# EAGLE schematic GETEWAY (EAGLE 9.5.1)
REV: 1

## Sheet 1 of 10
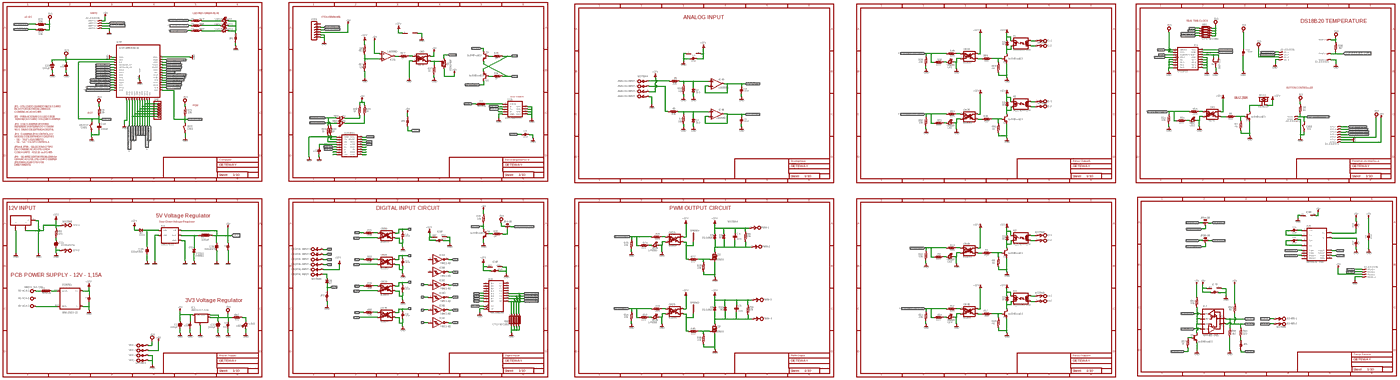
[diagram p0: schematic, sheet 1, overview]
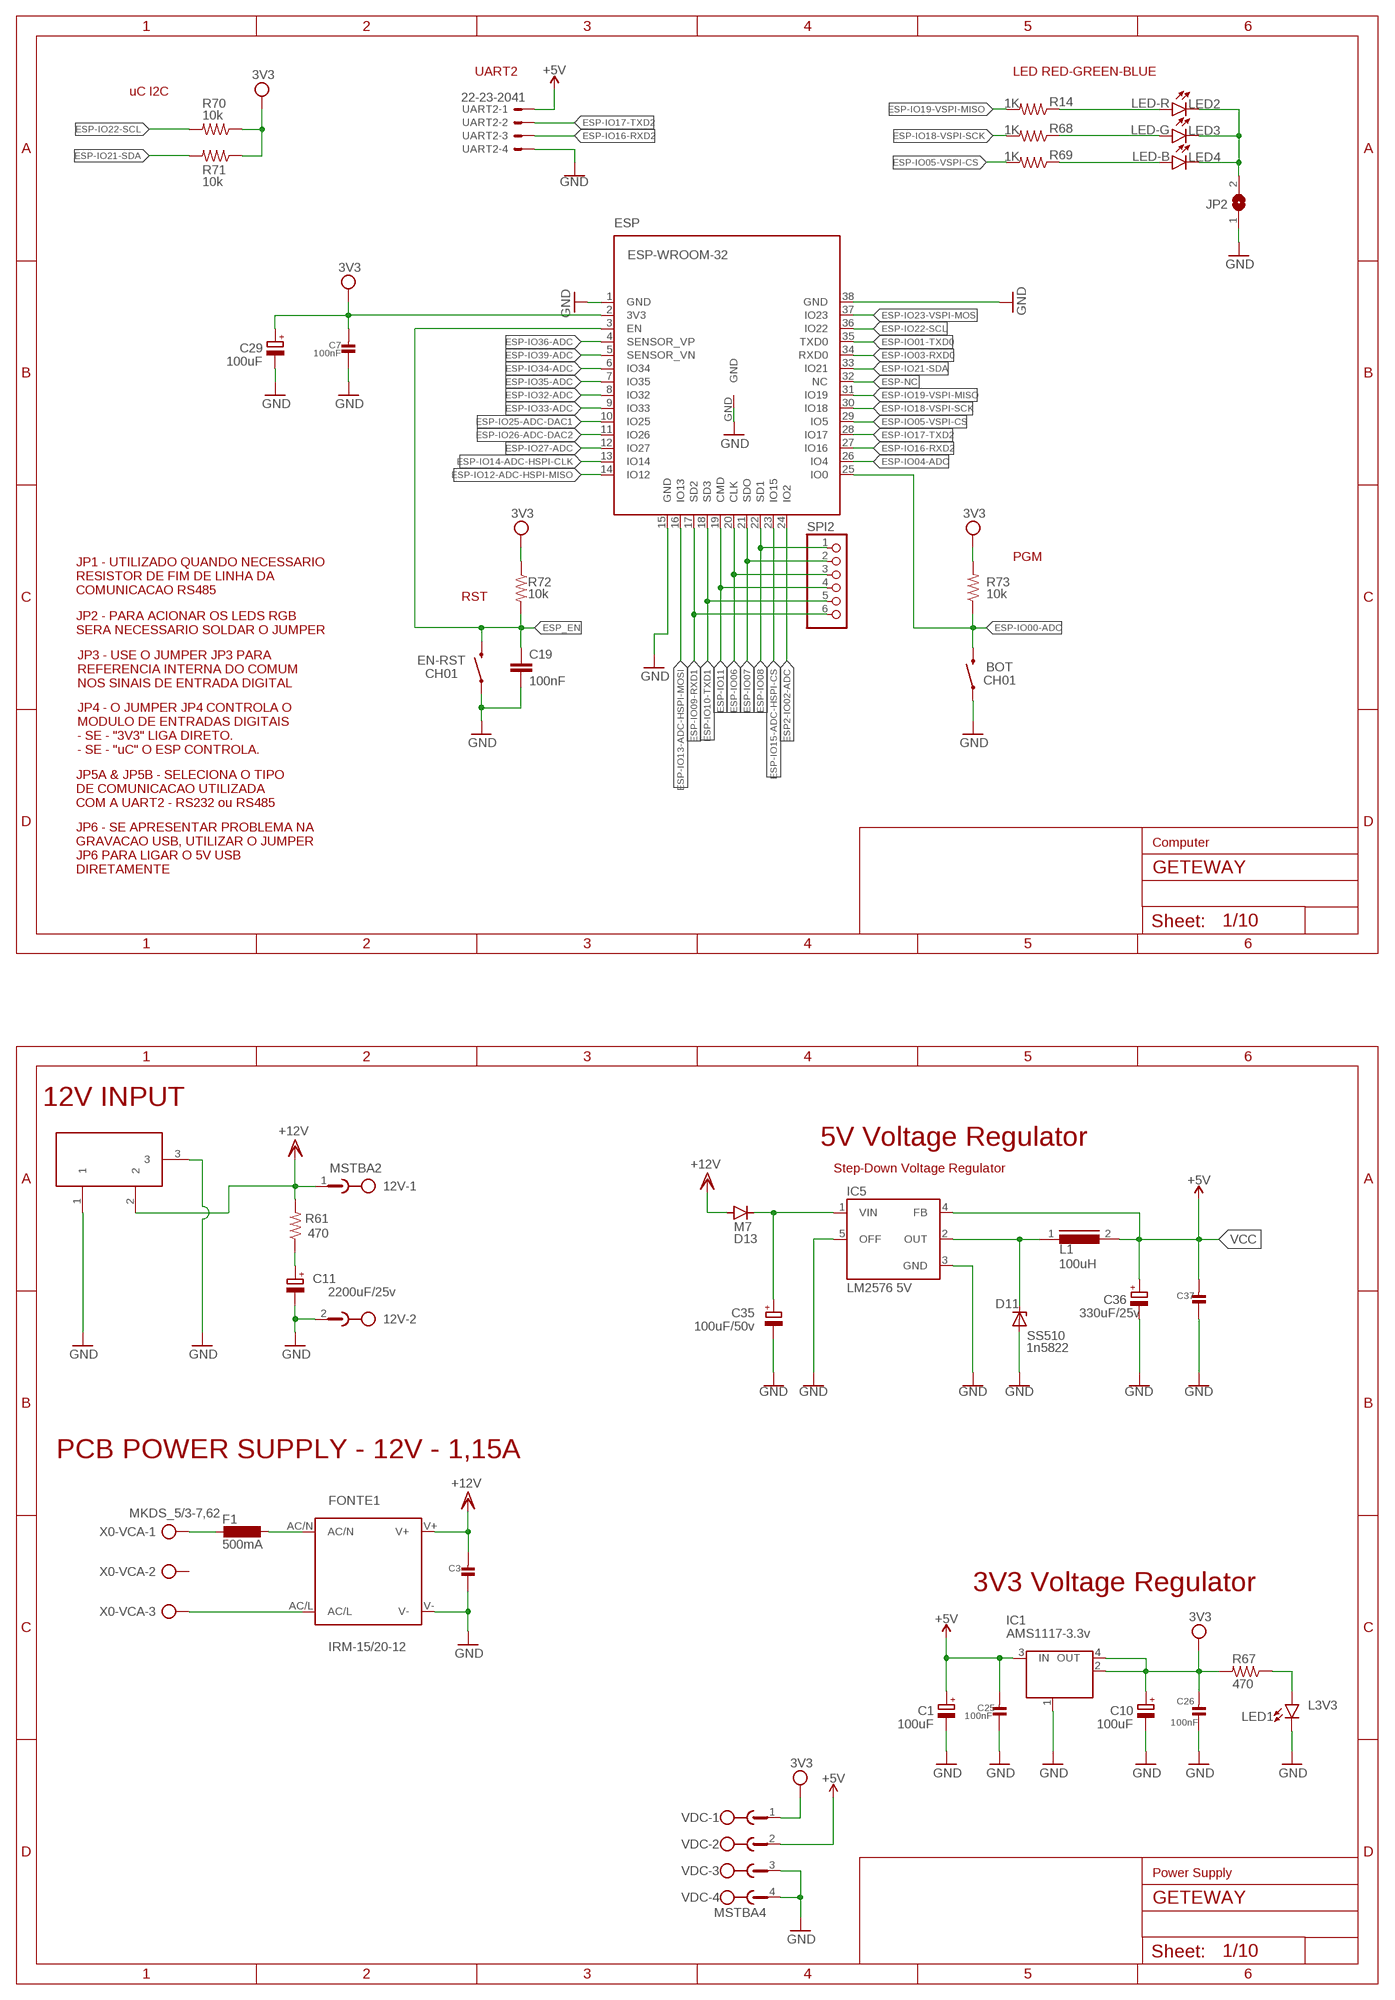
[diagram p1: schematic, sheet 1, part 1 of 4]
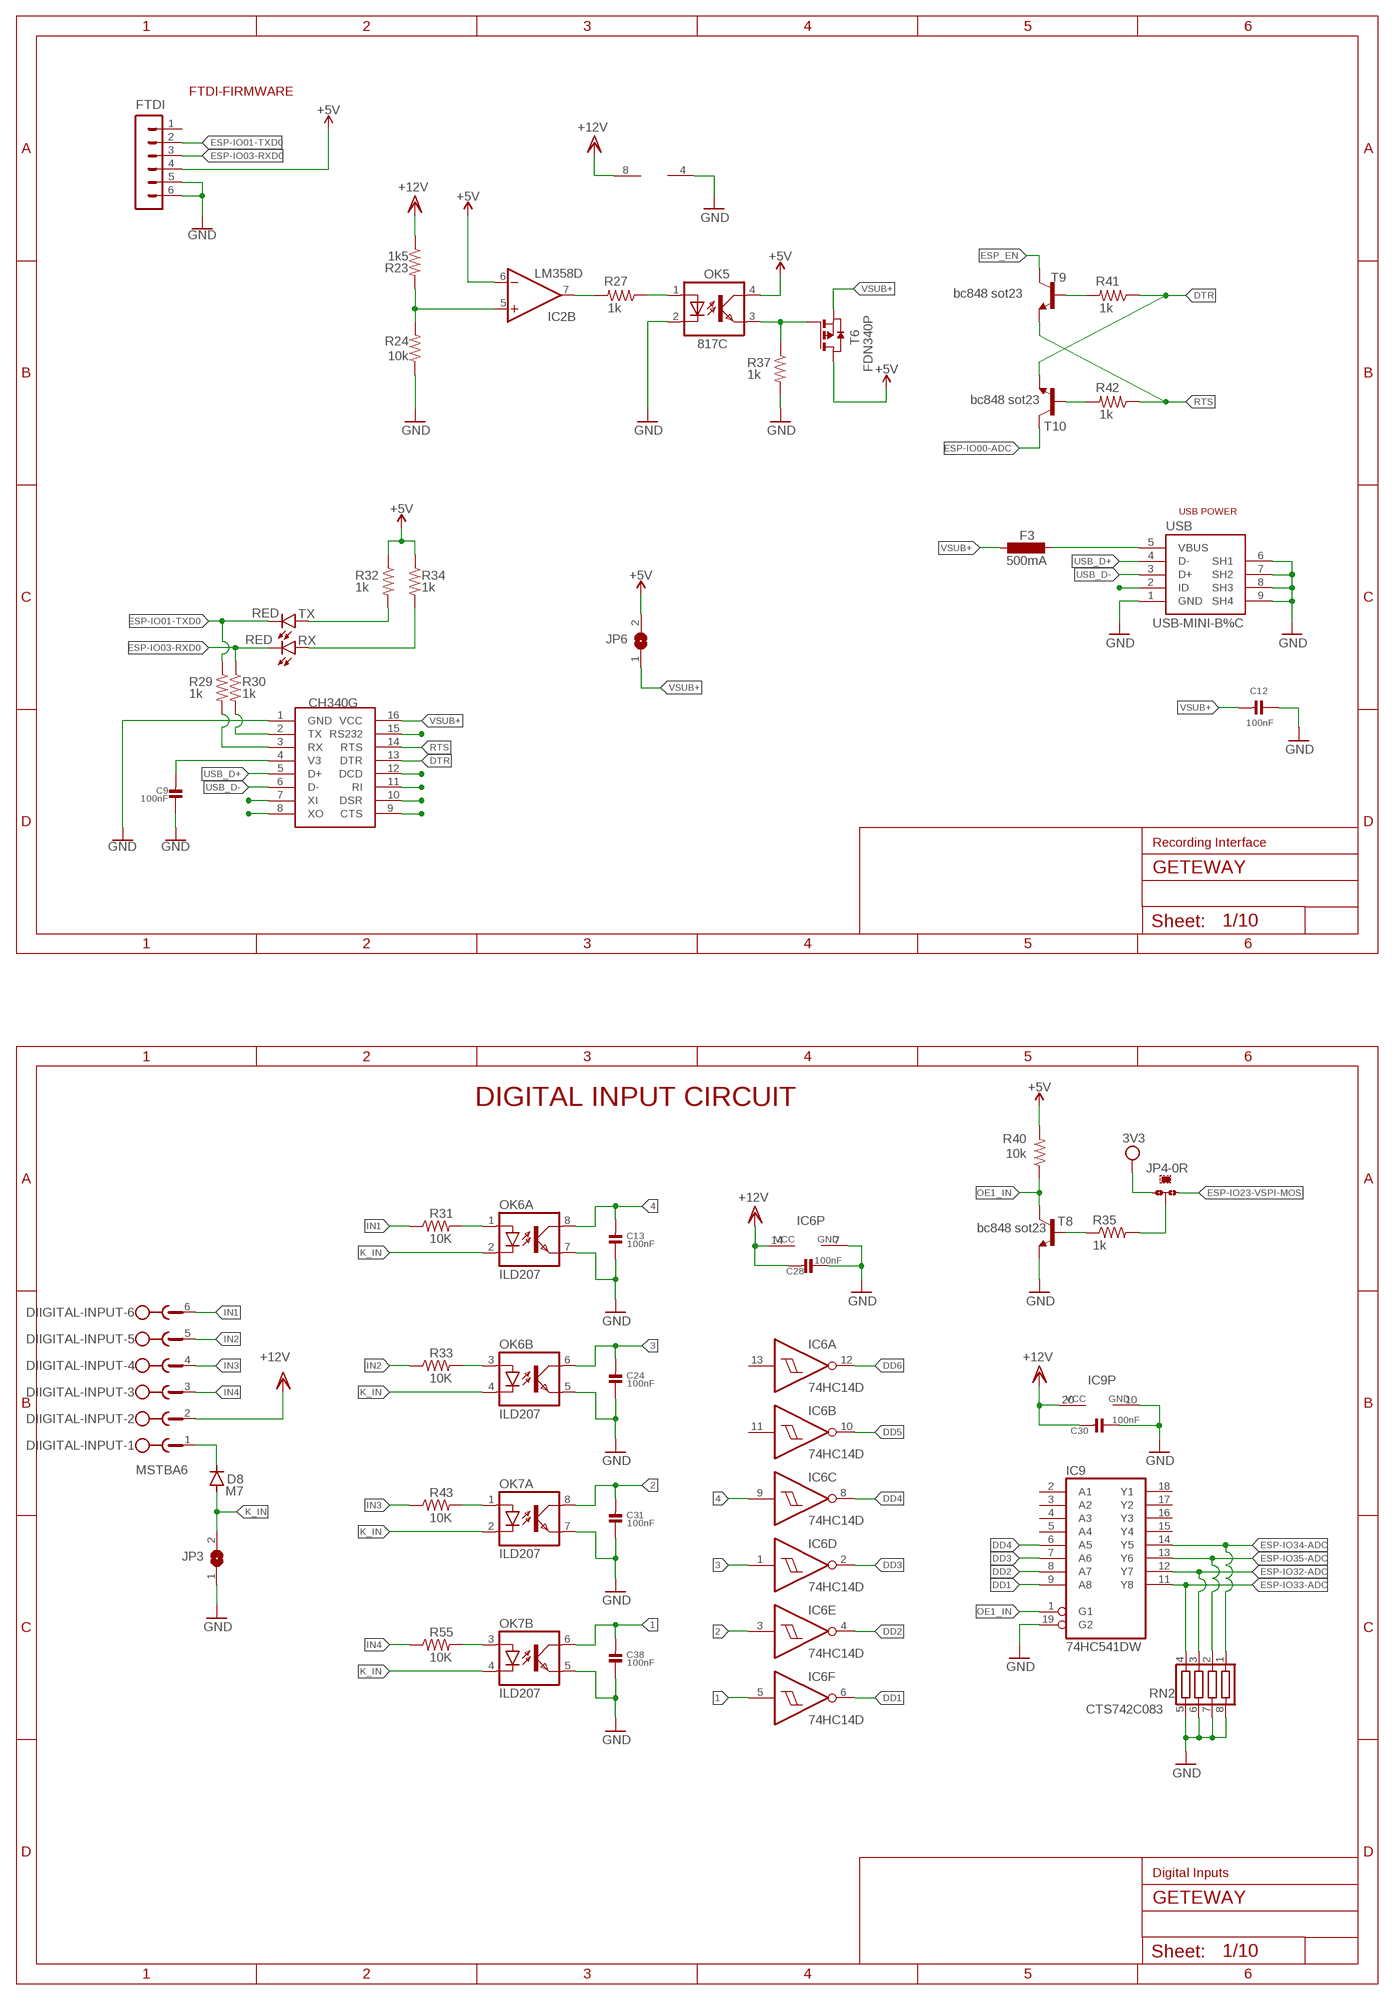
[diagram p2: schematic, sheet 1, part 2 of 4]
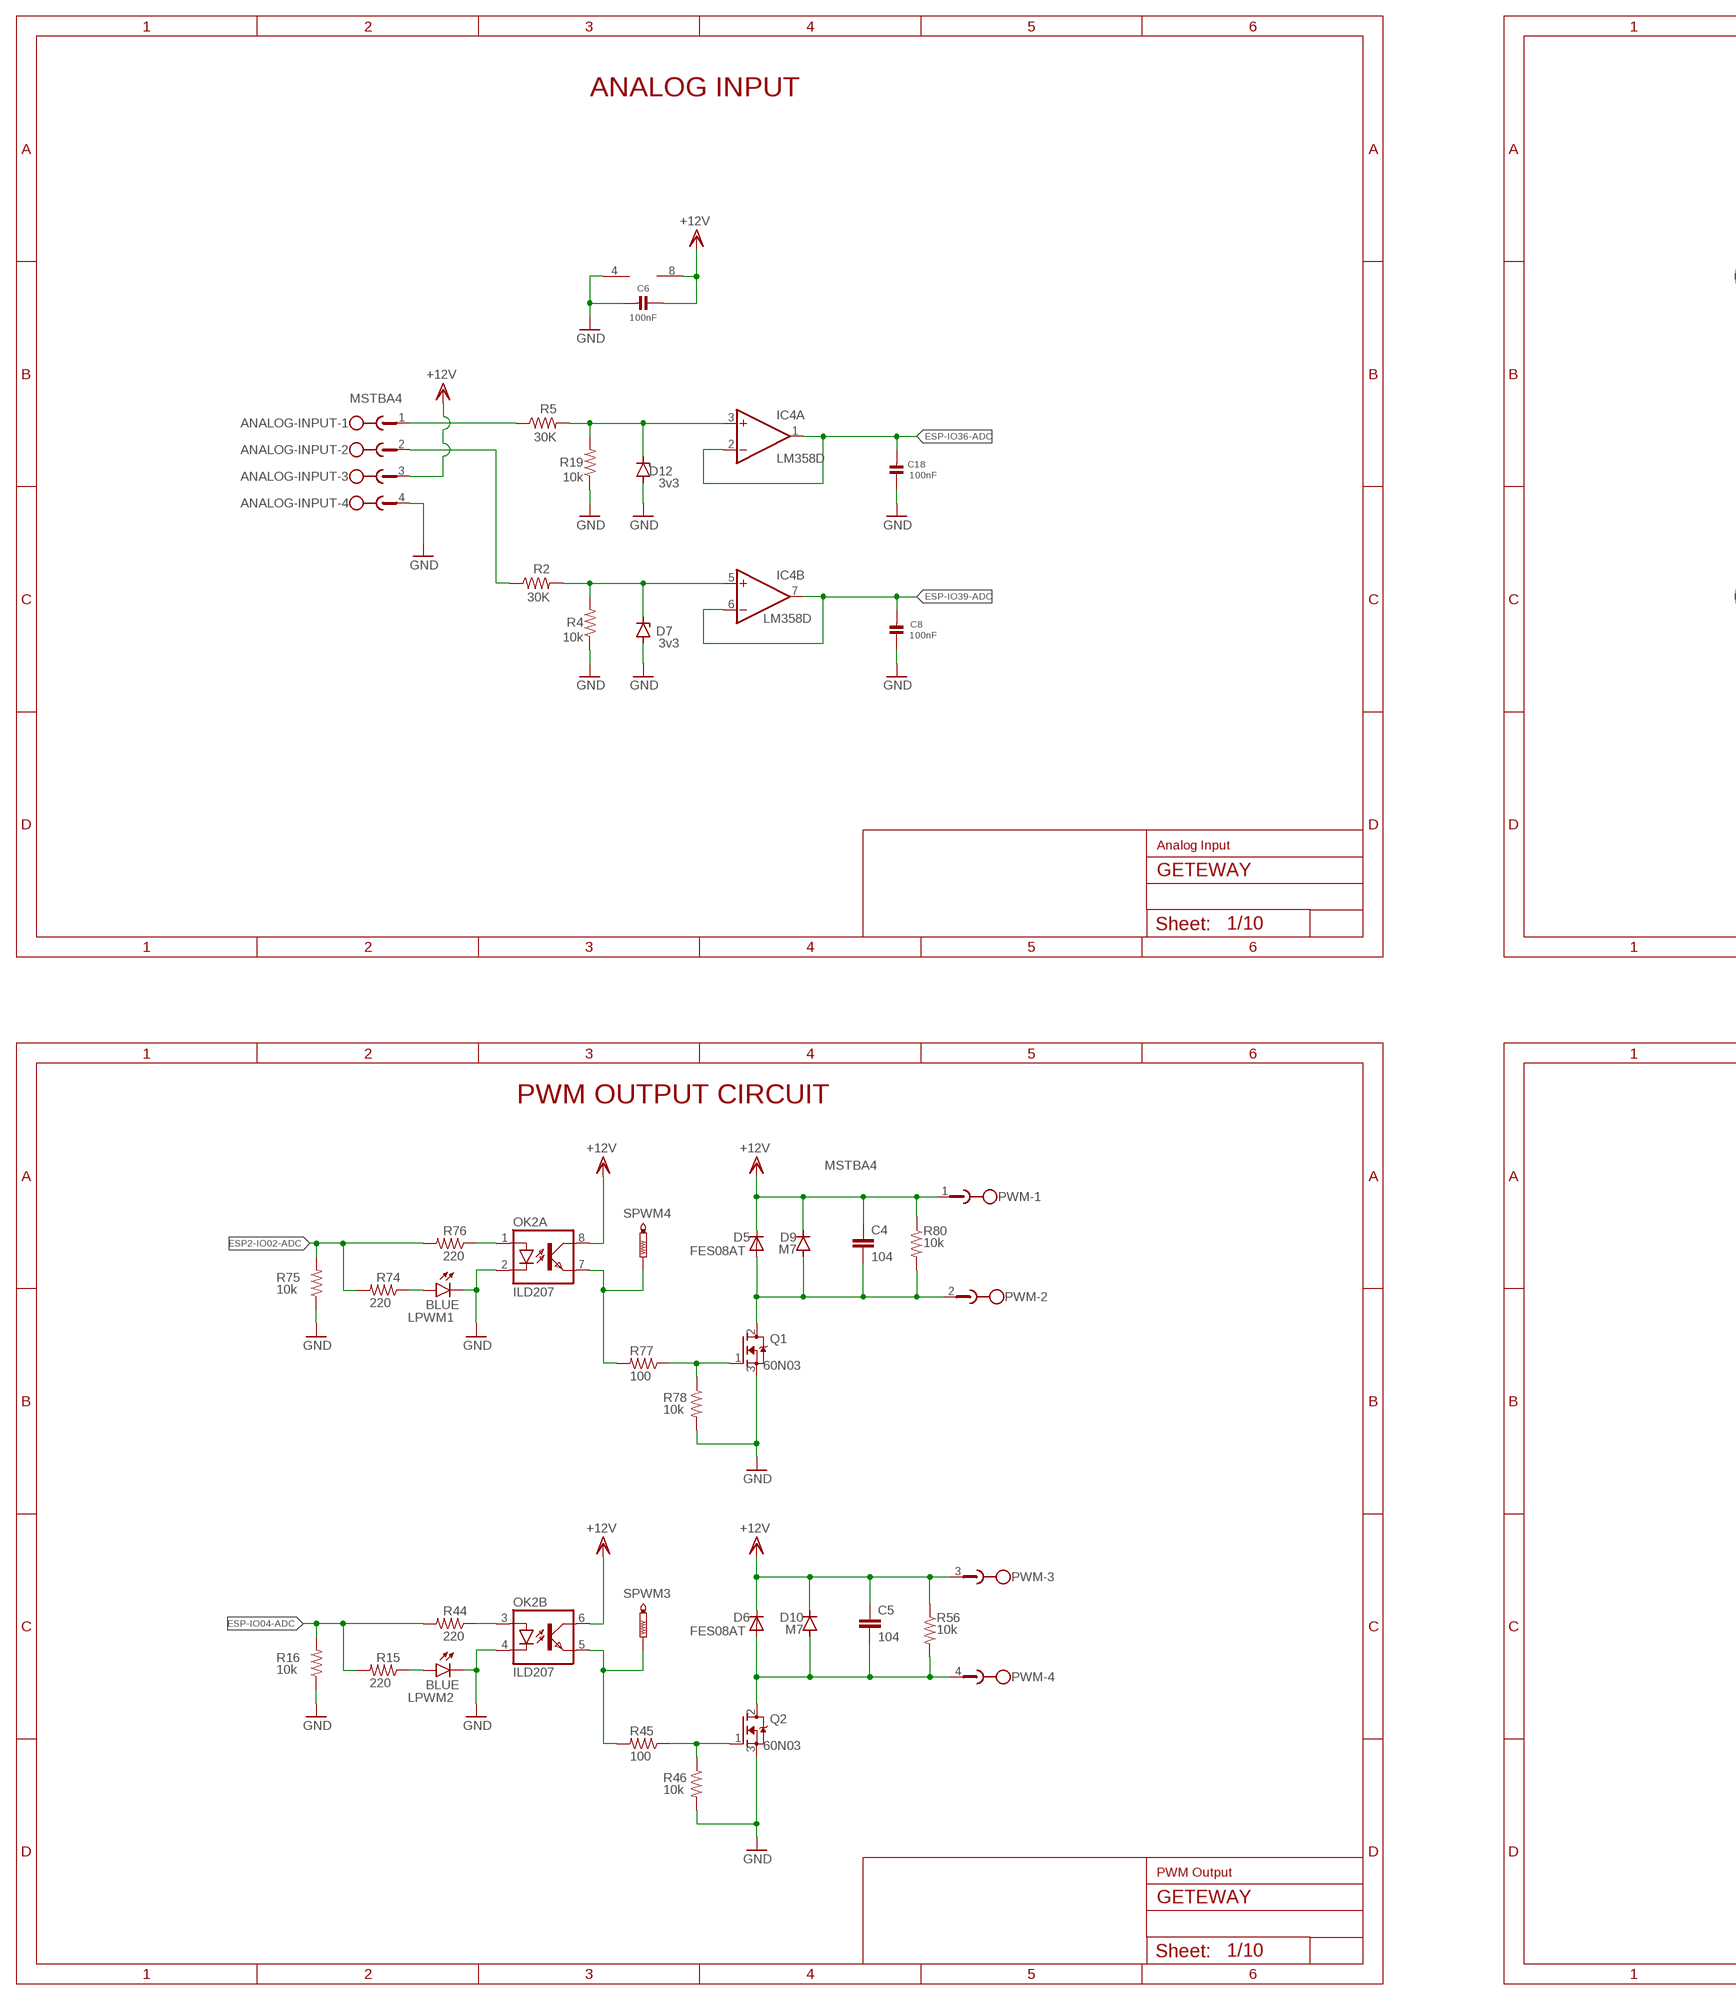
[diagram p3: schematic, sheet 1, part 3 of 4]
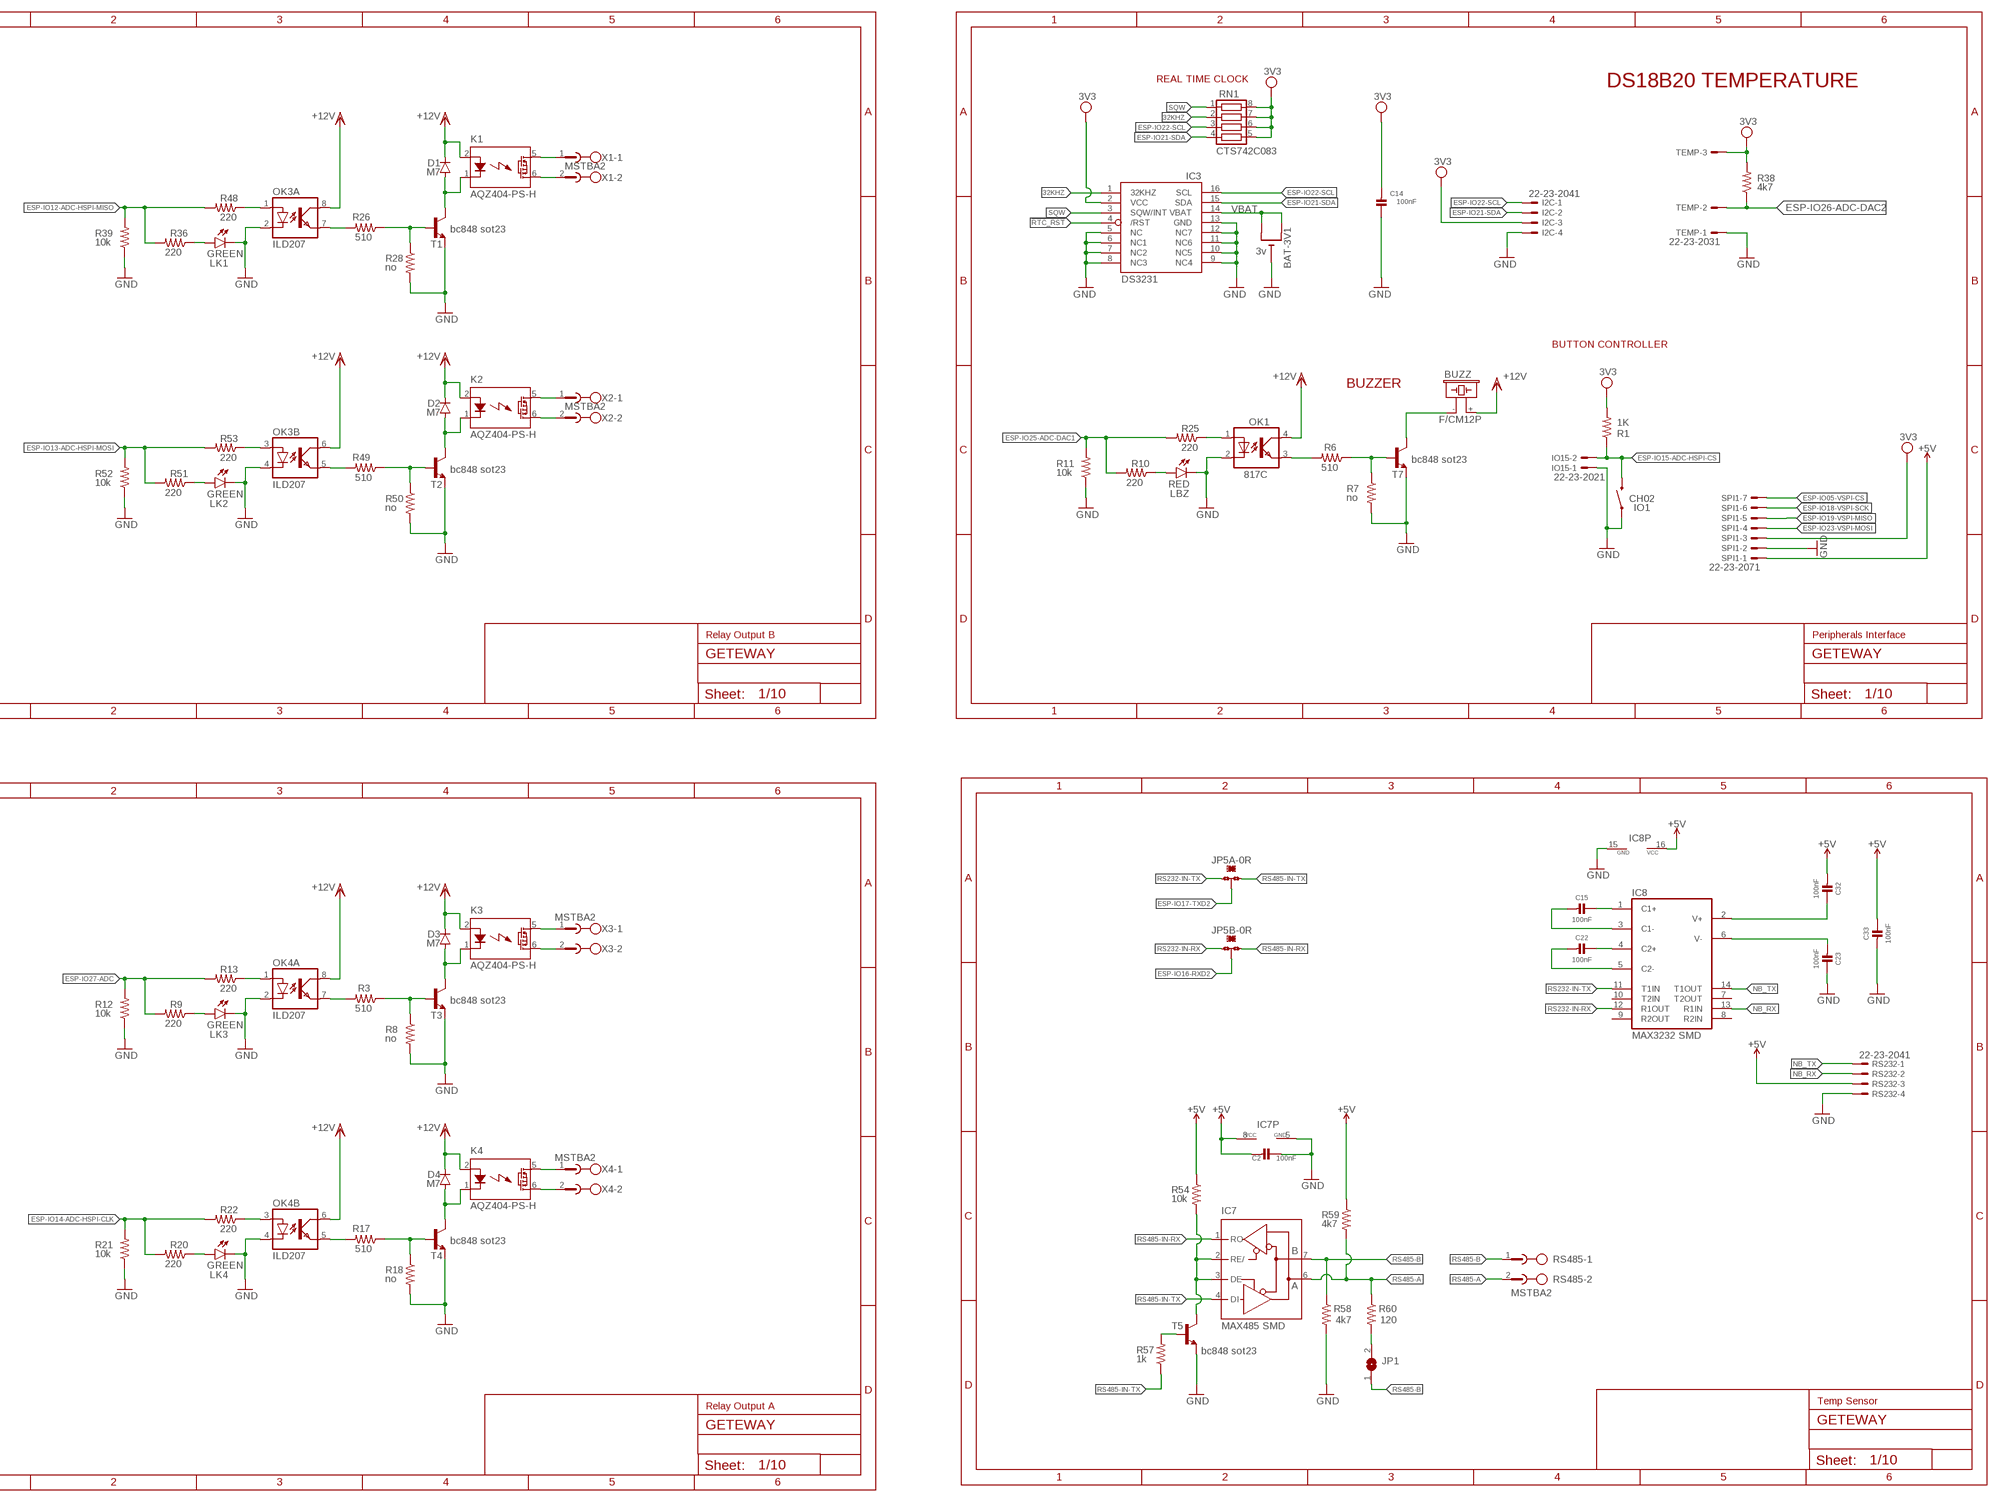
[diagram p4: schematic, sheet 1, part 4 of 4]

### Parts
7V-15VDC  DC21MMX  [DC-21MM]
12V  MSTBA2  [MSTBA2]
ANALOG-INPUT  MSTBA4  [MSTBA4]
BAT-3V1  3v  CR2032SMT  [CR2032-SMD]
BOT  CH01  MOMENTARY-SWITCH-SPST-SMD-6.0X3.5MM  [TACTILE_SWITCH_SMD_6.0X3.5MM]
BUZZ  F/CM12P  [F/CM12P]
C1  100uF  CPOL-EUE2.5-7  [E2,5-7]
C2  100nF  CAP_CERAMIC0805-NOOUTLINE  [0805-NO]
C3  100nF  CAP_CERAMIC0805-NOOUTLINE  [0805-NO]
C4  104  CAP0805  [0805]
C5  104  CAP0805  [0805]
C6  100nF  CAP_CERAMIC0805-NOOUTLINE  [0805-NO]
C7  100nF  CAP_CERAMIC0805-NOOUTLINE  [0805-NO]
C8  100nF  CAP_CERAMIC0805-NOOUTLINE  [0805-NO]
C9  100nF  CAP_CERAMIC0805-NOOUTLINE  [0805-NO]
C10  100uF  CPOL-EUE2.5-7  [E2,5-7]
C11  2200uF/25v  CPOL-EUE5-13  [E5-13]
C12  100nF  CAP_CERAMIC0805-NOOUTLINE  [0805-NO]
C13  100nF  CAP_CERAMIC0805-NOOUTLINE  [0805-NO]
C14  100nF  CAP_CERAMIC0805-NOOUTLINE  [0805-NO]
C15  100nF  CAP_CERAMIC0805-NOOUTLINE  [0805-NO]
C18  100nF  CAP_CERAMIC0805-NOOUTLINE  [0805-NO]
C19  100nF  C-EUC0603  [C0603]
C22  100nF  CAP_CERAMIC0805-NOOUTLINE  [0805-NO]
C23  100nF  CAP_CERAMIC0805-NOOUTLINE  [0805-NO]
C24  100nF  CAP_CERAMIC0805-NOOUTLINE  [0805-NO]
C25  100nF  CAP_CERAMIC0805-NOOUTLINE  [0805-NO]
C26  100nF  CAP_CERAMIC0805-NOOUTLINE  [0805-NO]
C28  100nF  CAP_CERAMIC0805-NOOUTLINE  [0805-NO]
C29  100uF  CPOL-EUE2.5-7  [E2,5-7]
C30  100nF  CAP_CERAMIC0805-NOOUTLINE  [0805-NO]
C31  100nF  CAP_CERAMIC0805-NOOUTLINE  [0805-NO]
C32  100nF  CAP_CERAMIC0805-NOOUTLINE  [0805-NO]
C33  100nF  CAP_CERAMIC0805-NOOUTLINE  [0805-NO]
C35  100uF/50v  CPOL-EUE3.5-8  [E3,5-8]
C36  330uF/25v  CPOL-EUE3.5-8  [E3,5-8]
C37  100nF  CAP_CERAMIC0805-NOOUTLINE  [0805-NO]
C38  100nF  CAP_CERAMIC0805-NOOUTLINE  [0805-NO]
D1  M7  DIODE-SMB  [SMB]
D2  M7  DIODE-SMB  [SMB]
D3  M7  DIODE-SMB  [SMB]
D4  M7  DIODE-SMB  [SMB]
D5  FES08AT  [DO220S]
D6  FES08AT  [DO220S]
D7  3v3  ZENER-DIODESMB  [SMB]
D8  M7  DIODE-SMB  [SMB]
D9  M7  DIODE-SMB  [SMB]
D10  M7  DIODE-SMB  [SMB]
D11  SS510  ZENER-DIODESMB  [SMB]
D12  3v3  ZENER-DIODESMB  [SMB]
D13  M7  DIODE-SMB  [SMB]
DIIGITAL-INPUT  MSTBA6  [MSTBA6]
EN-RST  CH01  MOMENTARY-SWITCH-SPST-SMD-6.0X3.5MM  [TACTILE_SWITCH_SMD_6.0X3.5MM]
ESP  ESP-WROOM-32  [ESP-WROOM-32]
F1  500mA  L-EUL1812  [L1812]
F3  500mA  L-EUL1812  [L1812]
FONTE1  IRM-15/20-12  IRM_15/20  [IRM_15/20]
FTDI  MA06-1  [MA06-1]
I2C  22-23-2041  [22-23-2041]
IC1  AMS1117-3.3v  MC33269ST-3.3T3  [SOT223]
IC2  LM358D  [SO08]
IC3  DS3231/SO  [SO16W]
IC4  LM358D  [SO08]
IC5  LM2576 5V  LM2576S  [TO263-5]
IC6  74HC14D  [SO14]
IC7  MAX485 SMD  MAX481CSA  [SO08]
IC8  MAX3232 SMD  MAX3232CSE  [SO16]
IC9  74HC541DW  [SO20W]
IO1  CH02  MOMENTARY-SWITCH-SPST-SMD-6.0X3.5MM  [TACTILE_SWITCH_SMD_6.0X3.5MM]
IO15  22-23-2021  [22-23-2021]
JP1  SJ  [SJ]
JP2  SJ  [SJ]
JP3  SJ  [SJ]
JP4  0R-JUMPA  [A0R-JMP]
JP5A  0R-JUMPA  [A0R-JMP]
JP5B  0R-JUMPA  [A0R-JMP]
JP6  SJ  [SJ]
K1  AQZ404-PS-H  [AQZ404-PS-H]
K2  AQZ404-PS-H  [AQZ404-PS-H]
K3  AQZ404-PS-H  [AQZ404-PS-H]
K4  AQZ404-PS-H  [AQZ404-PS-H]
L1  100uH  DR125  [DR125]
L3V3  LED1  LEDCHIPLED_0805  [CHIPLED_0805]
LBZ  RED  LEDCHIPLED_0805  [CHIPLED_0805]
LED-B  LED4  LEDCHIPLED_0805  [CHIPLED_0805]
LED-G  LED3  LEDCHIPLED_0805  [CHIPLED_0805]
LED-R  LED2  LEDCHIPLED_0805  [CHIPLED_0805]
LK1  GREEN  LEDCHIPLED_0805  [CHIPLED_0805]
LK2  GREEN  LEDCHIPLED_0805  [CHIPLED_0805]
LK3  GREEN  LEDCHIPLED_0805  [CHIPLED_0805]
LK4  GREEN  LEDCHIPLED_0805  [CHIPLED_0805]
LPWM1  BLUE  LEDCHIPLED_0805  [CHIPLED_0805]
LPWM2  BLUE  LEDCHIPLED_0805  [CHIPLED_0805]
OK1  817C  SFH618A-5X007  [SMD4-7]
OK2  ILD207  [SOIC08]
OK3  ILD207  [SOIC08]
OK4  ILD207  [SOIC08]
OK5  817C  SFH618A-5X007  [SMD4-7]
OK6  ILD207  [SOIC08]
OK7  ILD207  [SOIC08]
PWM  MSTBA4  [MSTBA4]
Q1  60N03  AP70T03GH-HF-3TR  [TRANS_AP70T03GH-HF-3TR]
Q2  60N03  AP70T03GH-HF-3TR  [TRANS_AP70T03GH-HF-3TR]
R1  1K  R-US_R0805  [R0805]
R2  30K  R-US_R0603  [R0603]
R3  510  R-US_R0603  [R0603]
R4  10k  R-US_R0603  [R0603]
R5  30K  R-US_R0603  [R0603]
R6  510  R-US_R0603  [R0603]
R7  no  R-US_R0603  [R0603]
R8  no  R-US_R0603  [R0603]
R9  220  R-US_R0603  [R0603]
R10  220  R-US_R0603  [R0603]
R11  10k  R-US_R0603  [R0603]
R12  10k  R-US_R0603  [R0603]
R13  220  R-US_R0603  [R0603]
R14  1K  R-US_R0805  [R0805]
R15  220  R-US_R0603  [R0603]
R16  10k  R-US_R0603  [R0603]
R17  510  R-US_R0603  [R0603]
R18  no  R-US_R0603  [R0603]
R19  10k  R-US_R0603  [R0603]
R20  220  R-US_R0603  [R0603]
R21  10k  R-US_R0603  [R0603]
R22  220  R-US_R0603  [R0603]
R23  1k5  R-US_R0603  [R0603]
R24  10k  R-US_R0603  [R0603]
R25  220  R-US_R0603  [R0603]
R26  510  R-US_R0603  [R0603]
R27  1k  R-US_R0603  [R0603]
R28  no  R-US_R0603  [R0603]
R29  1k  R-US_R0603  [R0603]
R30  1k  R-US_R0603  [R0603]
R31  10K  R-US_M1206  [M1206]
R32  1k  R-US_R0603  [R0603]
R33  10K  R-US_M1206  [M1206]
R34  1k  R-US_R0603  [R0603]
R35  1k  R-US_R0603  [R0603]
R36  220  R-US_R0603  [R0603]
R37  1k  R-US_R0603  [R0603]
R38  4k7  R-US_R0603  [R0603]
R39  10k  R-US_R0603  [R0603]
R40  10k  R-US_R0603  [R0603]
R41  1k  R-US_R0603  [R0603]
R42  1k  R-US_R0603  [R0603]
R43  10K  R-US_M1206  [M1206]
R44  220  R-US_R0603  [R0603]
R45  100  R-US_R0603  [R0603]
R46  10k  R-US_R0603  [R0603]
R48  220  R-US_R0603  [R0603]
R49  510  R-US_R0603  [R0603]
R50  no  R-US_R0603  [R0603]
R51  220  R-US_R0603  [R0603]
R52  10k  R-US_R0603  [R0603]
R53  220  R-US_R0603  [R0603]
R54  10k  R-US_R0603  [R0603]
R55  10K  R-US_M1206  [M1206]
R56  10k  R-US_R0603  [R0603]
R57  1k  R-US_R0603  [R0603]
R58  4k7  R-US_R0603  [R0603]
R59  4k7  R-US_R0603  [R0603]
R60  120  R-US_R0603  [R0603]
R61  470  R-US_M1206  [M1206]
R67  470  R-US_R0603  [R0603]
R68  1K  R-US_R0805  [R0805]
R69  1K  R-US_R0805  [R0805]
R70  10k  R-US_R0603  [R0603]
R71  10k  R-US_R0603  [R0603]
R72  10k  R-US_R0603  [R0603]
R73  10k  R-US_R0603  [R0603]
R74  220  R-US_R0603  [R0603]
R75  10k  R-US_R0603  [R0603]
R76  220  R-US_R0603  [R0603]
R77  100  R-US_R0603  [R0603]
R78  10k  R-US_R0603  [R0603]
R80  10k  R-US_R0603  [R0603]
RN1  CTS742C083  [CTS742C083]
RN2  CTS742C083  [CTS742C083]
RS232  22-23-2041  [22-23-2041]
RS485  MSTBA2  [MSTBA2]
RX  RED  LEDCHIPLED_0805  [CHIPLED_0805]
SPI1  22-23-2071  [22-23-2071]
SPI2  PINHD-1X6  [1X06]
SPWM3  PTR1PAD1-17  [P1-17]
SPWM4  PTR1PAD1-17  [P1-17]
T1  bc848 sot23  BC848-NPN-SOT23-BEC  [SOT23-BEC]
T2  bc848 sot23  BC848-NPN-SOT23-BEC  [SOT23-BEC]
T3  bc848 sot23  BC848-NPN-SOT23-BEC  [SOT23-BEC]
T4  bc848 sot23  BC848-NPN-SOT23-BEC  [SOT23-BEC]
T5  bc848 sot23  BC848-NPN-SOT23-BEC  [SOT23-BEC]
T6  FDN340P  PMOSSOT23  [SOT-23]
T7  bc848 sot23  BC848-NPN-SOT23-BEC  [SOT23-BEC]
T8  bc848 sot23  MMBT3904LT1-NPN-SOT23-BEC  [SOT23-BEC]
T9  bc848 sot23  MMBT3904LT1-NPN-SOT23-BEC  [SOT23-BEC]
T10  bc848 sot23  MMBT3904LT1-NPN-SOT23-BEC  [SOT23-BEC]
TEMP  22-23-2031  [22-23-2031]
TX  RED  LEDCHIPLED_0805  [CHIPLED_0805]
U2  CH340G  [SOIC16]
UART2  22-23-2041  [22-23-2041]
USB  USB-MINI-B%C  [USB-MINI-B_2]
VDC  MSTBA4  [MSTBA4]
X0-VCA  MKDS_5/3-7,62  [MKDS_5/3-762]
X1  MSTBA2  [MSTBA2]
X2  MSTBA2  [MSTBA2]
X3  MSTBA2  [MSTBA2]
X4  MSTBA2  [MSTBA2]

### Nets
1: C38.2 IC6.5(F:I) OK7.6(B:COL)
2: C31.2 IC6.3(E:I) OK7.8(A:COL)
3: C24.2 IC6.1(D:I) OK6.6(B:COL)
4: C13.2 IC6.9(C:I) OK6.8(A:COL)
32KHZ: IC3.1(32KHZ) RN1.2
!RTC_RST: IC3.4(/RST)
DD1: IC6.6(F:O) IC9.9(A8)
DD2: IC6.4(E:O) IC9.8(A7)
DD3: IC6.2(D:O) IC9.7(A6)
DD4: IC6.8(C:O) IC9.6(A5)
DD5: IC6.10(B:O)
DD6: IC6.12(A:O)
DTR: R41.1 T10.E U2.13(DTR)
ESP2-IO02-ADC: ESP.24(IO2) R74.2 R75.2 R76.2
ESP-IO00-ADC: BOT.2 ESP.25(IO0) R73.1 T10.C
ESP-IO01-TXD0: ESP.35(TXD0) FTDI.2 R29.1 TX.C
ESP-IO03-RXD0: ESP.34(RXD0) FTDI.3 R30.1 RX.C
ESP-IO04-ADC: ESP.26(IO4) R15.2 R16.2 R44.2
ESP-IO05-VSPI-CS: ESP.29(IO5) R69.2 SPI1.7
ESP-IO06: ESP.20(CLK) SPI2.3
ESP-IO07: ESP.21(SDO) SPI2.2
ESP-IO08: ESP.22(SD1) SPI2.1
ESP-IO09-RXD1: ESP.17(SD2) SPI2.6
ESP-IO10-TXD1: ESP.18(SD3) SPI2.5
ESP-IO11: ESP.19(CMD) SPI2.4
ESP-IO12-ADC-HSPI-MISO: ESP.14(IO12) R36.2 R39.2 R48.2
ESP-IO13-ADC-HSPI-MOSI: ESP.16(IO13) R51.2 R52.2 R53.2
ESP-IO14-ADC-HSPI-CLK: ESP.13(IO14) R20.2 R21.2 R22.2
ESP-IO15-ADC-HSPI-CS: ESP.23(IO15) IO1.2 IO15.2 R1.1
ESP-IO16-RXD2: ESP.27(IO16) JP5B.2 UART2.3
ESP-IO17-TXD2: ESP.28(IO17) JP5A.2 UART2.2
ESP-IO18-VSPI-SCK: ESP.30(IO18) R68.2 SPI1.6
ESP-IO19-VSPI-MISO: ESP.31(IO19) R14.2 SPI1.5
ESP-IO21-SDA: ESP.33(IO21) I2C.2 IC3.15(SDA) R71.2 RN1.4
ESP-IO22-SCL: ESP.36(IO22) I2C.1 IC3.16(SCL) R70.2 RN1.3
ESP-IO23-VSPI-MOSI: ESP.37(IO23) JP4.1 SPI1.4
ESP-IO25-ADC-DAC1: ESP.10(IO25) R10.2 R11.2 R25.2
ESP-IO26-ADC-DAC2: ESP.11(IO26) R38.1 TEMP.2
ESP-IO27-ADC: ESP.12(IO27) R9.2 R12.2 R13.2
ESP-IO32-ADC: ESP.8(IO32) IC9.12(Y7) RN2.3
ESP-IO33-ADC: ESP.9(IO33) IC9.11(Y8) RN2.4
ESP-IO34-ADC: ESP.6(IO34) IC9.14(Y5) RN2.1
ESP-IO35-ADC: ESP.7(IO35) IC9.13(Y6) RN2.2
ESP-IO36-ADC: C18.2 ESP.4(SENSOR_VP) IC4.1(A:OUT) IC4.2(A:-IN)
ESP-IO36-ADC1: IC2.7(B:OUT) R27.2
ESP-IO39-ADC: C8.2 ESP.5(SENSOR_VN) IC4.6(B:-IN) IC4.7(B:OUT)
ESP-NC: ESP.32(NC)
ESP_EN: C19.1 EN-RST.2 ESP.3(EN) R72.2 T9.C
GND [power]: 7V-15VDC.1 7V-15VDC.3 12V.2 ANALOG-INPUT.4 BAT-3V1.- BOT.1 C1.- C2.1 C3.1 C6.2 C7.1 C8.1 C9.1 C10.- C11.- C12.1 C13.1 C14.1 C18.1 C19.2 C23.1 C24.1 C25.1 C26.1 C28.1 C29.- C30.1 C31.1 C33.2 C35.- C36.- C37.1 C38.1 D7.A D11.A D12.A EN-RST.1 ESP.1(GND) ESP.15(GND) ESP.38(GND) ESP.GND FONTE1.V- FTDI.5 FTDI.6 I2C.4 IC1.1(GND/ADJ) IC2.4(P:V-) IC3.5(NC) IC3.6(NC1) IC3.7(NC2) IC3.8(NC3) IC3.9(NC4) IC3.10(NC5) IC3.11(NC6) IC3.12(NC7) IC3.13(GND) IC4.4(P:V-) IC5.3(GND) IC5.5(OFF) IC6.7(P:GND) IC7.5(GND) IC8.15(GND) IC9.10(GND) IC9.19(G2) IO1.1 IO15.1 JP2.1 JP3.1 L3V3.C LBZ.C LK1.C LK2.C LK3.C LK4.C LPWM1.C LPWM2.C OK1.2(C) OK2.2(A:C) OK2.4(B:C) OK3.2(A:C) OK3.4(B:C) OK4.2(A:C) OK4.4(B:C) OK5.2(C) OK6.5(B:EMIT) OK6.7(A:EMIT) OK7.5(B:EMIT) OK7.7(A:EMIT) Q1.3(S) Q2.3(S) R4.1 R7.2 R8.2 R11.1 R12.1 R16.1 R18.2 R19.1 R21.1 R24.1 R28.2 R37.2 R39.1 R46.2 R50.2 R52.1 R58.2 R75.1 R78.2 RN2.5 RN2.6 RN2.7 RN2.8 RS232.4 SPI1.2 T1.E T2.E T3.E T4.E T5.E T7.E T8.E TEMP.1 U2.1(GND) UART2.4 USB.1(GND) USB.6(SH1) USB.7(SH2) USB.8(SH3) USB.9(SH4) VDC.3 VDC.4
IN1: DIIGITAL-INPUT.6 R31.1
IN2: DIIGITAL-INPUT.5 R33.1
IN3: DIIGITAL-INPUT.4 R43.1
IN4: DIIGITAL-INPUT.3 R55.1
K_IN: D8.A JP3.2 OK6.2(A:C) OK6.4(B:C) OK7.2(A:C) OK7.4(B:C)
N$1: D1.A K1.1(K) T1.C
N$2: R26.1 R28.1 T1.B
N$3: OK3.7(A:EMIT) R26.2
N$4: C15.1 IC8.1(C1+)
N$5: C15.2 IC8.3(C1-)
N$6: C22.1 IC8.4(C2+)
N$7: C22.2 IC8.5(C2-)
N$8: C23.2 IC8.6(V-)
N$9: C32.1 IC8.2(V+)
N$10: BUZZ.- T7.C
N$11: R6.1 R7.1 T7.B
N$12: K1.5(DS1) X1.1
N$13: K1.6(DS2) X1.2
N$14: K2.5(DS1) X2.1
N$15: ANALOG-INPUT.1 R5.1
N$16: ANALOG-INPUT.2 R2.1
N$17: D3.A K3.1(K) T3.C
N$18: OK3.1(A:A) R48.1
N$19: D7.C IC4.5(B:+IN) R2.2 R4.2
N$20: OK1.3(EMIT) R6.2
N$21: OK1.1(A) R25.1
N$22: R3.1 R8.1 T3.B
N$23: LBZ.A R10.1
N$24: LK1.A R36.1
N$25: OK4.7(A:EMIT) R3.2
N$26: USB.2(ID)
N$27: LED-R.A R14.1
N$28: R35.1 T8.B
N$29: D2.A K2.1(K) T2.C
N$30: K3.5(DS1) X3.1
N$31: K3.6(DS2) X3.2
N$32: K4.5(DS1) X4.1
N$33: R49.1 R50.1 T2.B
N$34: OK6.1(A:A) R31.2
N$35: OK6.3(B:A) R33.2
N$36: OK4.1(A:A) R13.1
N$37: LK3.A R9.1
N$38: LED-G.A R68.1
N$39: LED-B.A R69.1
N$40: D4.A K4.1(K) T4.C
N$41: R17.1 R18.1 T4.B
N$42: OK3.5(B:EMIT) R49.2
N$43: OK2.3(B:A) R44.1
N$45 [power]: JP2.2 LED-B.C LED-G.C LED-R.C
N$46: U2.8(XO)
N$47: U2.7(XI)
N$48: C9.2 U2.4(V3)
N$49: R29.2 U2.3(RX)
N$50: R30.2 U2.2(TX)
N$51 [vcc]: R34.2 RX.A
N$52: OK7.1(A:A) R43.2
N$53: LPWM2.A R15.1
N$54: OK7.3(B:A) R55.2
N$55: OK2.5(B:EMIT) R45.2 SPWM3.TP
N$56: D8.C DIIGITAL-INPUT.1
N$57: JP4.2 R35.2
N$58: D12.C IC4.3(A:+IN) R5.2 R19.2
N$59: K2.6(DS2) X2.2
N$60: F1.2 X0-VCA.1
N$61: F1.1 FONTE1.AC/N
N$62: OK3.3(B:A) R53.1
N$63: LK2.A R51.1
N$64: IC2.5(B:+IN) R23.2 R24.2
N$65: K4.6(DS2) X4.2
N$66: OK5.1(A) R27.1
N$67: Q2.1(G) R45.1 R46.1
N$68: C5.2 D6.A D10.A PWM.4 Q2.2(D) R56.2
N$69: OK2.1(A:A) R76.1
N$70: LPWM1.A R74.1
N$71: OK2.7(A:EMIT) R77.2 SPWM4.TP
N$72: Q1.1(G) R77.1 R78.1
N$73: OK5.3(EMIT) R37.1 T6.3(G)
N$74: F3.1 USB.5(VBUS)
N$75: FONTE1.AC/L X0-VCA.3
N$78: C4.2 D5.A D9.A PWM.2 Q1.2(D) R80.2
N$82: R57.2 T5.B
N$83: IC7.2(RE/) IC7.3(DE) R54.2 T5.C
N$86: L3V3.A R67.1
N$87: C11.+ R61.1
N$88: JP1.2 R60.2
N$91: D11.C IC5.2(OUT) L1.1
N$92 [power]: C35.+ D13.C IC5.1(VIN)
N$93 [vcc]: R32.2 TX.A
N$95: U2.15(RS232)
N$96: R42.2 T10.B
N$97: OK4.5(B:EMIT) R17.2
N$101: OK4.3(B:A) R22.1
N$102: R41.2 T9.B
N$103: U2.12(DCD)
N$104: U2.11(RI)
N$105: U2.10(DSR)
N$106: U2.9(CTS)
N$107: LK4.A R20.1
NB_RX: IC8.13(R1IN) RS232.2
NB_TX: IC8.14(T1OUT) RS232.1
OE1_IN: IC9.1(G1) R40.1 T8.C
RS232-IN-RX: IC8.12(R1OUT) JP5B.3
RS232-IN-TX: IC8.11(T1IN) JP5A.3
RS485-A: IC7.6(A) R59.2 R60.1 RS485.2
RS485-B: IC7.7(B) JP1.1 R58.1 RS485.1
RS485-IN-RX: IC7.1(RO) JP5B.1
RS485-IN-TX: IC7.4(DI) JP5A.1 R57.1
RTS: R42.1 T9.E U2.14(RTS)
SQW: IC3.3(SQW/INT) RN1.1
USB_D+: U2.5(D+) USB.4(D-)
USB_D-: U2.6(D-) USB.3(D+)
VBAT: BAT-3V1.+$1(+) BAT-3V1.+$2(+1) IC3.14(VBAT)
VCC [vcc]: C1.+ C2.2 C25.2 C32.2 C33.1 C36.+ C37.2 FTDI.4 IC1.3(IN) IC2.6(B:-IN) IC5.4(FB) IC7.8(VCC) IC8.16(VCC) JP6.2 L1.2 OK5.4(COL) R32.1 R34.1 R40.2 R54.1 R59.1 RS232.3 SPI1.1 T6.1(D) UART2.1 VDC.2 ; supply symbol labelled +5V
VDD [power]: 7V-15VDC.2 12V.1 ANALOG-INPUT.3 BUZZ.+ C3.2 C4.1 C5.1 C6.1 C28.2 C30.2 D1.C D2.C D3.C D4.C D5.C D6.C D9.C D10.C D13.A DIIGITAL-INPUT.2 FONTE1.V+ IC2.8(P:V+) IC4.8(P:V+) IC6.14(P:VCC) IC9.20(VCC) K1.2(A) K2.2(A) K3.2(A) K4.2(A) OK1.4(COL) OK2.6(B:COL) OK2.8(A:COL) OK3.6(B:COL) OK3.8(A:COL) OK4.6(B:COL) OK4.8(A:COL) PWM.1 PWM.3 R23.1 R56.1 R61.2 R80.1 ; supply symbol labelled +12V
VEE [vcc]: C7.2 C10.+ C14.2 C26.2 C29.+ ESP.2(3V3) I2C.3 IC1.2(OUT) IC1.4(OUT) IC3.2(VCC) JP4.3 R1.2 R38.2 R67.2 R70.1 R71.1 R72.1 R73.2 RN1.5 RN1.6 RN1.7 RN1.8 SPI1.3 TEMP.3 VDC.1 ; supply symbol labelled 3V3
VSUB+ [vcc]: C12.2 F3.2 JP6.1 T6.2(S) U2.16(VCC)
Unconnected: FTDI.1 IC2.1(A:OUT) IC2.2(A:-IN) IC2.3(A:+IN) IC6.11(B:I) IC6.13(A:I) IC8.7(T2OUT) IC8.8(R2IN) IC8.9(R2OUT) IC8.10(T2IN) IC9.2(A1) IC9.3(A2) IC9.4(A3) IC9.5(A4) IC9.15(Y4) IC9.16(Y3) IC9.17(Y2) IC9.18(Y1) X0-VCA.2

### Notes on the sheet
- UART2 | LED RED-GREEN-BLUE
- uC I2C | FTDI-FIRMWARE
- ANALOG INPUT
- REAL TIME CLOCK
- DS18B20 TEMPERATURE
- BUTTON CONTROLLER
- USB POWER
- BUZZER
- PGM
- JP1 - UTILIZADO QUANDO NECESSARIO 
  RESISTOR DE FIM DE LINHA DA
  COMUNICACAO RS485
- RST
- JP2 - PARA ACIONAR OS LEDS RGB
  SERA NECESSARIO SOLDAR O JUMPER
- JP3 - USE O JUMPER JP3 PARA 
  REFERENCIA INTERNA DO COMUM
  NOS SINAIS DE ENTRADA DIGITAL
- JP4 - O JUMPER JP4 CONTROLA O 
  MODULO DE ENTRADAS DIGITAIS
  - SE - "3V3" LIGA DIRETO.
  - SE - "uC" O ESP CONTROLA.
- JP5A & JP5B - SELECIONA O TIPO
  DE COMUNICACAO UTILIZADA 
  COM A UART2 - RS232 ou RS485
- Computer | Recording Interface
- Analog Input | Relay Output B | Peripherals Interface
- JP6 - SE APRESENTAR PROBLEMA NA 
  GRAVACAO USB, UTILIZAR O JUMPER
  JP6 PARA LIGAR O 5V USB
  DIRETAMENTE
- 12V INPUT | DIGITAL INPUT CIRCUIT | PWM OUTPUT CIRCUIT
- 5V Voltage Regulator
- Step-Down Voltage Regulator
- 1n5822
- PCB POWER SUPPLY - 12V - 1,15A
- 3V3 Voltage Regulator
- Temp Sensor
- Power Supply | Digital Inputs | PWM Output | Relay Output A

## Sheet 2 of 10

## Sheet 3 of 10

## Sheet 4 of 10

## Sheet 5 of 10

## Sheet 6 of 10

## Sheet 7 of 10

## Sheet 8 of 10

## Sheet 9 of 10

## Sheet 10 of 10

## Library data of the parts
7V-15VDC = powersupply:DC21MM
12V RS485 X1-X4 = con-phoenix-508:MSTBA2: PHOENIX; MF: FARNELL; MPN: 1757242; OC_FARNELL: 3705171; OC_NEWARK: 71C4161
ANALOG-INPUT PWM VDC = con-phoenix-508:MSTBA4: PHOENIX; MF: FARNELL; MPN: 1757268; OC_FARNELL: 3705195; OC_NEWARK: 71C4163
BAT-3V1 = adafruit:CR2032
BOT EN-RST IO1 = SparkFun-Switches:MOMENTARY-SWITCH-SPST: Momentary Switch (Pushbutton) - SPST Normally-open (NO) SPST momentary switches (buttons, pushbuttons). Variants PTH-12MM - 12mm square, through-hole Momentary Pushbutton Switch - 12mm Square <https://www.sparkfun.com/products/9190> (COM-09190) PTH-6.0MM, PTH-6.0MM-KIT - 6.0mm square, through-hole Mini Pushbutton Switch <https://www.sparkfun.com/products/97> (COM-00097) KIT package intended for soldering kit's - only one side of pads' copper is exposed. PTH-RIGHT-ANGLE-KIT - Right-angle, through-hole Right Angle Tactile Button <https://www.sparkfun.com/products/10791> - Used on SparkFun BigTime Watch Kit <https://www.sparkfun.com/products/11734> SMD-12MM - 12mm square, surface-mount Tactile Button - SMD (12mm) <https://www.sparkfun.com/products/12993> (COM-12993) Used on SparkFun PicoBoard <https://www.sparkfun.com/products/11888> SMD-4.5MM - 4.5mm Square Trackball Switch Used on SparkFun Blackberry Trackballer Breakout <https://www.sparkfun.com/products/13169> SMD-4.6MMX2.8MM - 4.60mm x 2.80mm, surface mount Used on SparkFun SAMD21 Mini Breakout <https://www.sparkfun.com/products/13664> SMD-5.2MM, SMD-5.2-REDUNDANT - 5.2mm square, surface-mount Mini Pushbutton Switch - SMD <https://www.sparkfun.com/products/8720> (COM-08720) Used on Arduino Pro Mini <https://www.sparkfun.com/products/11114> REDUNDANT package connects both switch circuits together SMD-6.0X3.5MM - 6.0 x 3.5mm, surface mount Momentary Reset Switch SMD <https://www.sparkfun.com/products/8229> (COM-08229) SMD-6.2MM-TALL - 6.2mm square, surface mount Tactile Button - SMD (6mm) <https://www.sparkfun.com/products/12992> Used on SparkFun Digital Sandbox <https://www.sparkfun.com/products/12651> SMD-RIGHT-ANGLE - Right-angle, surface mount Used on SparkFun Block for Intel® Edison - Arduino <https://www.sparkfun.com/products/13036>; PROD_ID: SWCH-00815; SF_SKU: COM-08229
BUZZ = buzzer:F/CM12P: BUZZER Source: Buerklin; OC_FARNELL: unknown; OC_NEWARK: unknown
C1 C10 C11 C29 = rcl:CPOL-EU: POLARIZED CAPACITOR, European symbol; SPICEPREFIX: C
C2 C3 C6-C9 C12-C15 C18 C22-C26 C28 C30-C33 C37 C38 = microbuilder:CAP_CERAMIC: Ceramic Capacitors For new designs, use the packages preceded by an '_' character since they are more reliable: The following footprints should be used on most boards: _0402 - Standard footprint for regular board layouts _0603 - Standard footprint for regular board layouts _0805 - Standard footprint for regular board layouts _1206 - Standard footprint for regular board layouts For extremely tight-pitch boards where space is at a premium, the following 'micro-pitch' footprints can be used (smaller pads, no silkscreen outline, etc.): _0402MP - Micro-pitch footprint for very dense/compact boards _0603MP - Micro-pitch footprint for very dense/compact boards _0805MP - Micro-pitch footprint for very dense/compact boards _1206MP - Micro-pitch footprint for very dense/compact boards
C4 C5 = SparkFun-Passives:CAP: Capacitor Standard 0603 ceramic capacitor, and 0.1" leaded capacitor.
C19 = rcl:C-EU: CAPACITOR, European symbol; SPICEPREFIX: C
C35 C36 = rcl:CPOL-EU: POLARIZED CAPACITOR, European symbol
D1-D4 D8-D10 D13 = diode:DIODE-: DIODE
D5 D6 = diode:FES08AT: DIODE ultra-fast recovery rectifier
D7 D11 D12 = diode:ZENER-DIODE: Z-Diode
DIIGITAL-INPUT = con-phoenix-508:MSTBA6: PHOENIX; MF: FARNELL; MPN: 1757284; OC_FARNELL: 3705213; OC_NEWARK: 71C4165
ESP = esp32:ESP-WROOM-32
F1 F3 = rcl:L-EU: INDUCTOR, European symbol
FONTE1 = meanwell_irm_v5:IRM_15/20: 15 or 20 watt housing & pin compatible IRM 15 Vout [V] Imax [A] Pmax [W] Eff [%] 3.3 3.5 11.55 74 5 3 15 78 12 1.25 15 82 15 1 15 82 24 0.63 15.12 83 IRM 20 Vout [V] Imax [A] Pmax [W] Eff [%] 3.3 4.5 14.85 76 5 4 20 79 12 1.8 21.6 84 15 1.4 21.6 84 24 0.9 21.6 85
FTDI = con-lstb:MA06-1: PIN HEADER; OC_FARNELL: unknown; OC_NEWARK: unknown
I2C RS232 UART2 = con-molex:22-23-2041: .100" (2.54mm) Center Header - 4 Pin; MF: MOLEX; MPN: 22-23-2041; OC_FARNELL: 1462920; OC_NEWARK: 38C0355
IC1 = linear:MC33269ST*: Adjustable Output Low Dropout Voltage Regulator 800 mA Source: http://www.onsemi.com/pub/Collateral/MC33269-D.PDF
IC2 IC4 = linear:LM358: OP AMP also LM158; LM258; LM2904 Source: http://cache.national.com/ds/LM/LM158.pdf
IC3 = adafruit:DS3231
IC5 = v-reg-3:LM2576: National Semiconductor <http://www.national.com> 3.0A "Simple Switcher"(c) 52kHz, Vout 1.23-37V (HV: 57V), Vin 40V (HV: 60V), 50µA standby current
IC6 = 74xx-eu:74*14: Hex schmitt trigger INVERTER
IC7 = maxim:MAX481CSA: RS485 TRANSEIVER; MF: MAXIM; MPN: MAX481CSA; OC_FARNELL: unknown; OC_NEWARK: 90C3817
IC8 = maxim:MAX3232*: True RS-232 Transceivers 3.0V to 5.5V, Low-Power up to 1Mbps, Using Four 0.1µF External Capacitors Source: http://pdfserv.maxim-ic.com/en/ds/MAX3222-MAX3241.pdf; MPN: MAX3232CSE; OC_FARNELL: 9725490; OC_NEWARK: 90C2890
IC9 = 74xx-eu:74*541: Octal BUFFER and LINE DRIVER, 3-state
IO15 = con-molex:22-23-2021: .100" (2.54mm) Center Header - 2 Pin; MF: MOLEX; MPN: 22-23-2021; OC_FARNELL: 1462926; OC_NEWARK: 25C3832
JP1-JP3 JP6 = jumper:SJ: SMD solder JUMPER
JP4 JP5A JP5B = jump-0r-smd:0R-JUMP: SMD 0R 0805 Jumper
K1-K4 = relay:AQZ40: PhotoMOS Relay NAiS Source: http://www.panasonic-electric-works.com/catalogues/downloads/photomos/ds_x615_en_aqz10_20.pdf; MPN: AQZ404; OC_FARNELL: 1101853; OC_NEWARK: 13P1226
L1 = inductors:DR125: High Power Density, High Efficiency, Shielded Inductors Source: coiltronics_dr_series.pdf; SPICEPREFIX: L
L3V3 LBZ LED-B LED-G LED-R LK1-LK4 LPWM1 LPWM2 RX TX = led:LED: LED OSRAM: - CHIPLED LG R971, LG N971, LY N971, LG Q971, LY Q971, LO R971, LY R971 LH N974, LH R974 LS Q976, LO Q976, LY Q976 LO Q996 - Hyper CHIPLED LW Q18S LB Q993, LB Q99A, LB R99A - SideLED LS A670, LO A670, LY A670, LG A670, LP A670 LB A673, LV A673, LT A673, LW A673 LH A674 LY A675 LS A676, LA A676, LO A676, LY A676, LW A676 LS A679, LY A679, LG A679 - Hyper Micro SIDELED® LS Y876, LA Y876, LO Y876, LY Y876 LT Y87S - SmartLED LW L88C, LW L88S LB L89C, LB L89S, LG L890 LS L89K, LO L89K, LY L89K LS L896, LA L896, LO L896, LY L896 - TOPLED LS T670, LO T670, LY T670, LG T670, LP T670 LSG T670, LSP T670, LSY T670, LOP T670, LYG T670 LG T671, LOG T671, LSG T671 LB T673, LV T673, LT T673, LW T673 LH T674 LS T676, LA T676, LO T676, LY T676, LB T676, LH T676, LSB T676, LW T676 LB T67C, LV T67C, LT T67C, LS T67K, LO T67K, LY T67K, LW E67C LS E67B, LA E67B, LO E67B, LY E67B, LB E67C, LV E67C, LT E67C LW T67C LS T679, LY T679, LG T679 LS T770, LO T770, LY T770, LG T770, LP T770 LB T773, LV T773, LT T773, LW T773 LH T774 LS E675, LA E675, LY E675, LS T675 LS T776, LA T776, LO T776, LY T776, LB T776 LHGB T686 LT T68C, LB T68C - Hyper Mini TOPLED® LB M676 - Mini TOPLED Santana® LG M470 LS M47K, LO M47K, LY M47K Source: http://www.osram.convergy.de LUXEON: - LUMILED® LXK2-PW12-R00, LXK2-PW12-S00, LXK2-PW14-U00, LXK2-PW14-V00 LXK2-PM12-R00, LXK2-PM12-S00, LXK2-PM14-U00 LXK2-PE12-Q00, LXK2-PE12-R00, LXK2-PE12-S00, LXK2-PE14-T00, LXK2-PE14-U00 LXK2-PB12-K00, LXK2-PB12-L00, LXK2-PB12-M00, LXK2-PB14-N00, LXK2-PB14-P00, LXK2-PB14-Q00 LXK2-PR12-L00, LXK2-PR12-M00, LXK2-PR14-Q00, LXK2-PR14-R00 LXK2-PD12-Q00, LXK2-PD12-R00, LXK2-PD12-S00 LXK2-PH12-R00, LXK2-PH12-S00 LXK2-PL12-P00, LXK2-PL12-Q00, LXK2-PL12-R00 Source: www.luxeon.com KINGBRIGHT: KA-3528ASYC Source: www.kingbright.com
OK1 OK5 = optocoupler:SFH618?*: Optocoupler, Phototransistor Output, Low Input Current Source: Data sheet <http://www.vishay.com/docs/83673/sfh618.pdf>; MPN: SFH618A-5X007; OC_FARNELL: unknown; OC_NEWARK: 43K9546
OK2-OK4 OK6 OK7 = optocoupler:ILD2*: Siemens ILD205/206/207/211/213/217 DUAL PHOTOTRANSISTOR SMALL OUTLINE SURFACE MOUNT OPTOCOUPLER Source: 153385-da-01-en-Optocoupler_ILD205-T.pdf; MF: VISHAY/TELEFUNKEN; MPN: ILD207T; OC_FARNELL: 1469603; OC_NEWARK: 97C8648
Q1 Q2 = AP70T03GH-HF-3TR:AP70T03GH-HF-3TR: Mosfet Transistor, N Channel, 60 A, 30 V, 0.009 Ohm, 10 V, 1 V; AVAILABILITY: Unavailable; DESCRIPTION: Mosfet Transistor, N Channel, 60 A, 30 V, 0.009 Ohm, 10 V, 1 V; MF: Advanced Power Electronics; MP: AP70T03GH-HF-3TR; PACKAGE: TO-252 Advanced Power Electronics; PRICE: None
R1-R30 R32 R34-R42 R44-R46 R48-R54 R56-R60 R67-R78 R80 = rcl:R-US_: RESISTOR, American symbol; SPICEPREFIX: R
R31 R33 R43 R55 R61 = resistor:R-US_: RESISTOR, American symbol
RN1 RN2 = resistor-net:CTS742C083: Chip Resistor Array 4 Single Resistor Source: http://www.ctscorp.com/components/Datasheets/CTSChipArrayDs.pdf; OC_FARNELL: unknown; OC_NEWARK: unknown
SPI1 = con-molex:22-23-2071: .100" (2.54mm) Center Header - 7 Pin; MF: MOLEX; MPN: 22-23-2071; OC_FARNELL: 1654534; OC_NEWARK: 56H0445
SPI2 = pinhead:PINHD-1X6: PIN HEADER
SPWM3 SPWM4 = testpad:PTR1: TEST PIN
T1-T5 T7 T9 T10 = transistor:*-NPN-: NPN Transistror BF959 corrected 2008.03.06
T6 = zetex:PMOSSOT23: MOS FET; OC_FARNELL: unknown; OC_NEWARK: unknown
T8 = transistor-neu-to92:*-NPN-: NPN Transistror BF959 corrected 2008.03.06
TEMP = con-molex:22-23-2031: .100" (2.54mm) Center Header - 3 Pin; MF: MOLEX; MPN: 22-23-2031; OC_FARNELL: 1462950; OC_NEWARK: 30C0862
U2 = ch340g:CH340G
USB = MyCON2:USB-MINI-B
X0-VCA = con-phoenix-mkds_5:MKDS_5/3-: MKDS 5/3-6,35 Source: PHOENIX CONTACT; OC_FARNELL: unknown; OC_NEWARK: unknown

## Net classes
1 power: width 0.61 mm, drill 0.406 mm, clearance 0.203 mm
2 vcc: width 0.406 mm, drill 0.406 mm, clearance 0.254 mm